# Altium schematic sheet AmplifyEmit.SchDoc
size A4; SheetNumber: 2; SheetTotal: 3
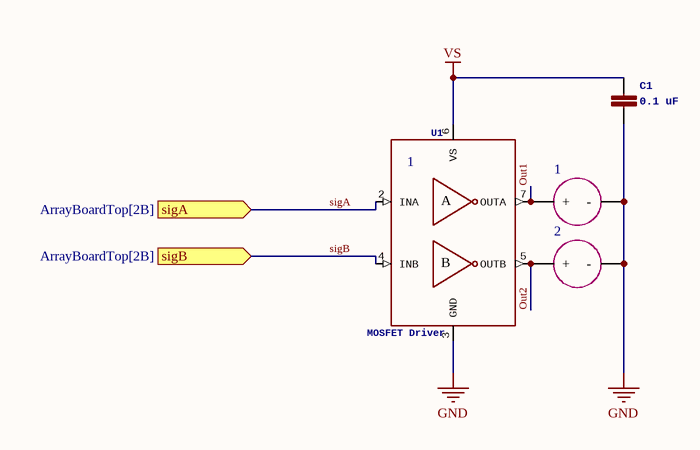
[diagram p0: AmplifyEmit.SchDoc]

## Parts
1  EMIT  [TRANSDUCER]  (value not drawn)
2  EMIT  [TRANSDUCER]  (value not drawn)
C1  0.1 uF  [CAP0805 - CERAMIC]
U1  MOSFET Driver  [MIC4127YME]

## Ports
sigA (in, see ArrayBoardTop[2B]), sigB (in, see ArrayBoardTop[2B])

## Nets
GND: 1.- 2.- C1.2 U1.3(GND)
VS: C1.1 U1.6(VS)
Out1: 1.+ U1.7(OUTA)
Out2: 2.+ U1.5(OUTB)
sigA: U1.2(INA) ; port sigA
sigB: U1.4(INB) ; port sigB

## Notes on the sheet
- (near U1) 1
- (in symbol MIC4127) A; B

## Library data of the parts
C1 = CAP CERAMIC
U1 = MIC4127